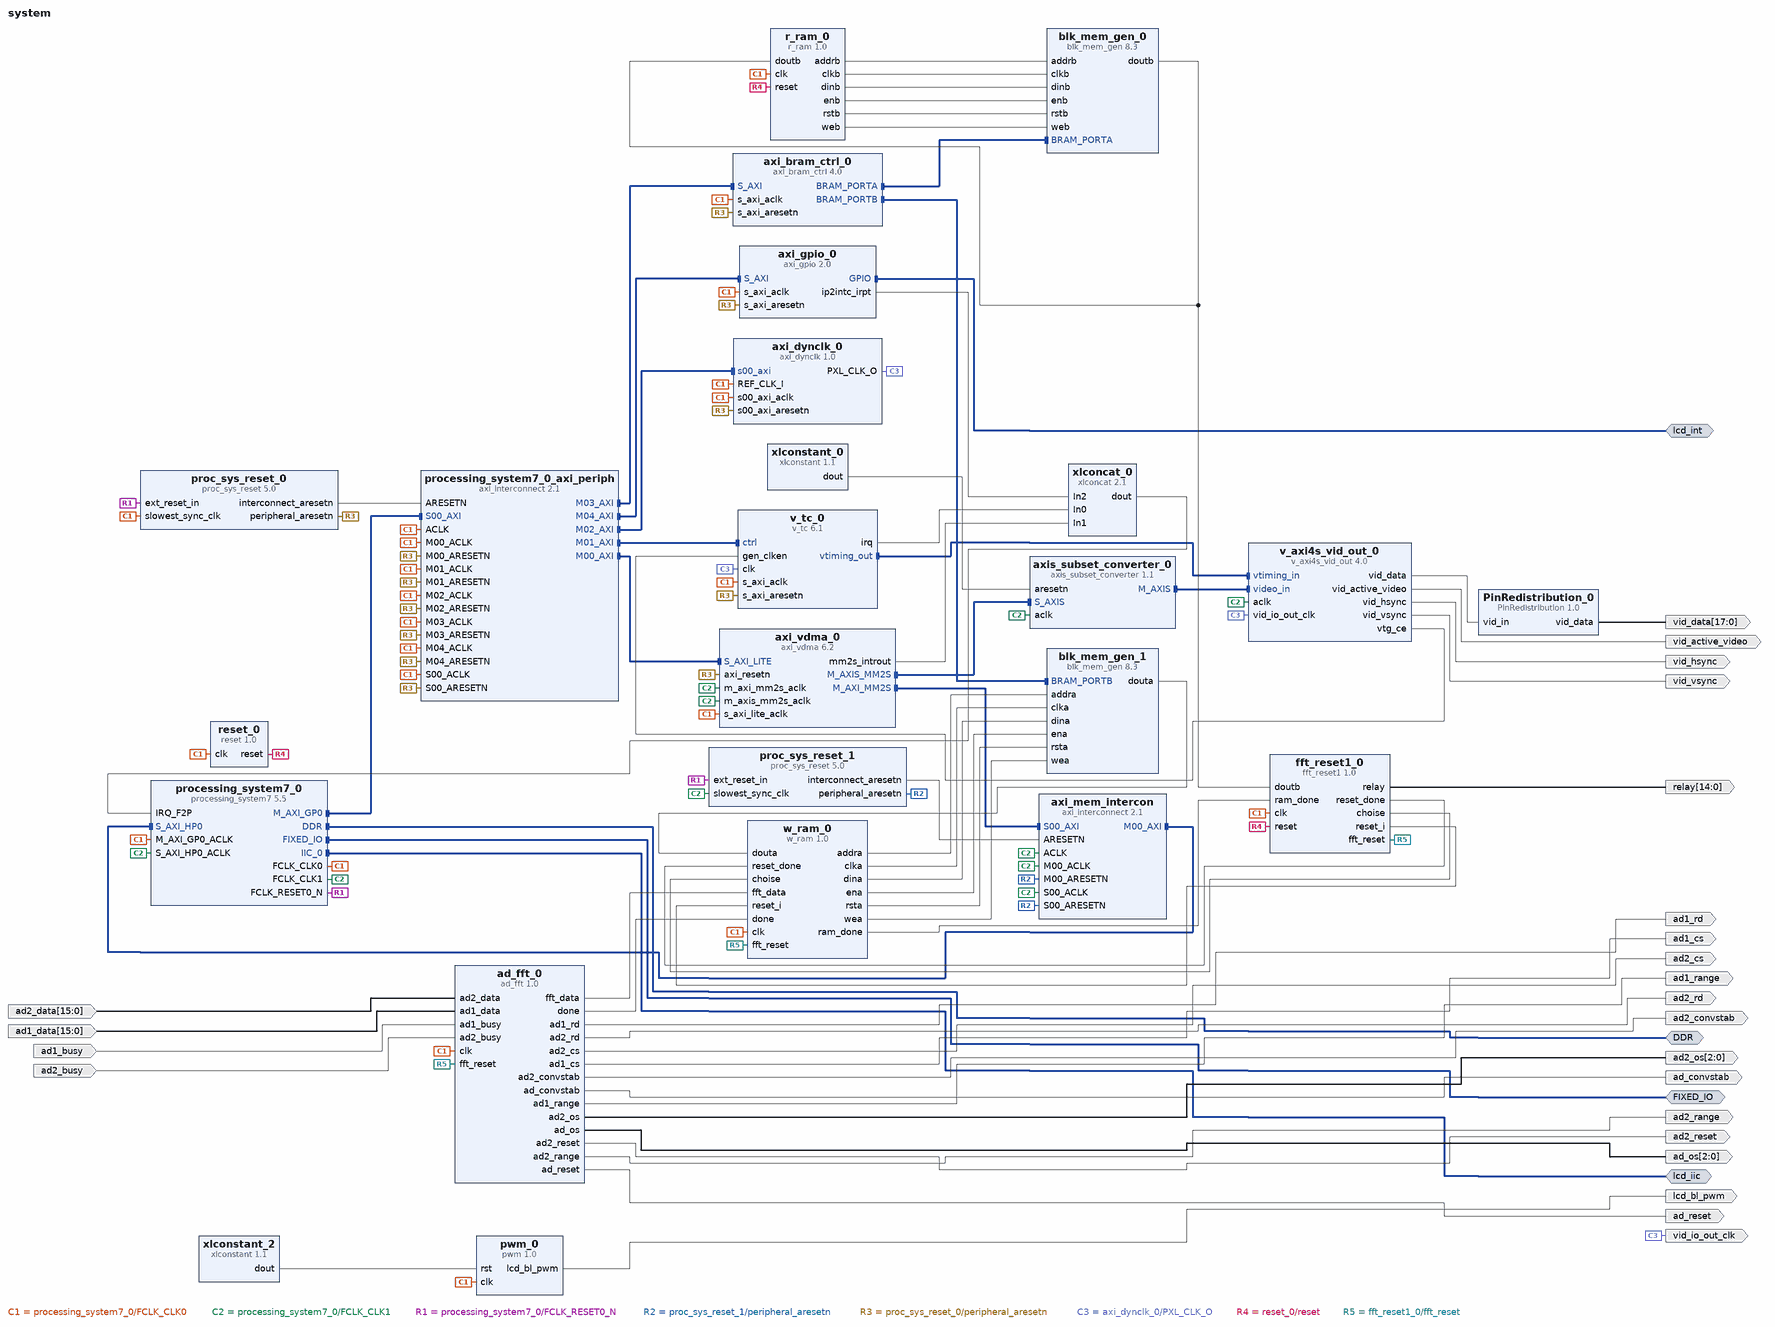
[diagram p0: block diagram of the top level]
# Vivado block design system, Vivado 2015.4
create_bd_design system

create_bd_intf_port -mode Master -vlnv xilinx.com:interface:ddrx_rtl:1.0 DDR
create_bd_intf_port -mode Master -vlnv xilinx.com:display_processing_system7:fixedio_rtl:1.0 FIXED_IO
create_bd_intf_port -mode Master -vlnv xilinx.com:interface:iic_rtl:1.0 lcd_iic
create_bd_intf_port -mode Master -vlnv xilinx.com:interface:gpio_rtl:1.0 lcd_int
create_bd_port -dir O -type clk vid_io_out_clk
create_bd_port -dir O vid_active_video
create_bd_port -dir O vid_hsync
create_bd_port -dir O vid_vsync
create_bd_port -dir O lcd_bl_pwm
create_bd_port -dir I -from 15 -to 0 ad2_data
create_bd_port -dir I -from 15 -to 0 ad1_data
create_bd_port -dir I ad1_busy
create_bd_port -dir I ad2_busy
create_bd_port -dir O ad2_rd
create_bd_port -dir O ad1_rd
create_bd_port -dir O ad2_cs
create_bd_port -dir O ad_convstab
create_bd_port -dir O -from 2 -to 0 ad_os
create_bd_port -dir O ad1_cs
create_bd_port -dir O ad2_convstab
create_bd_port -dir O -type rst ad2_reset
create_bd_port -dir O -type rst ad_reset
create_bd_port -dir O -from 2 -to 0 ad2_os
create_bd_port -dir O ad1_range
create_bd_port -dir O ad2_range
create_bd_port -dir O -from 14 -to 0 relay
create_bd_port -dir O -from 17 -to 0 vid_data

create_bd_cell -type ip -vlnv digilentinc.com:ip:axi_dynclk:1.0 axi_dynclk_0
create_bd_cell -type ip -vlnv xilinx.com:ip:axi_gpio:2.0 axi_gpio_0
set_property -dict {CONFIG.C_GPIO_WIDTH 1 CONFIG.C_ALL_INPUTS 1 CONFIG.C_INTERRUPT_PRESENT 1} [get_bd_cells axi_gpio_0]
create_bd_cell -type ip -vlnv xilinx.com:ip:axi_interconnect:2.1 axi_mem_intercon
set_property -dict {CONFIG.NUM_MI 1} [get_bd_cells axi_mem_intercon]
create_bd_cell -type ip -vlnv xilinx.com:ip:axi_vdma:6.2 axi_vdma_0
set_property -dict [list \
  CONFIG.c_num_fstores 1 \
  CONFIG.c_mm2s_genlock_mode 0 \
  CONFIG.c_mm2s_linebuffer_depth 4096 \
  CONFIG.c_include_s2mm 0 \
  CONFIG.c_include_mm2s_dre 1 \
] [get_bd_cells axi_vdma_0]
create_bd_cell -type ip -vlnv xilinx.com:ip:axis_subset_converter:1.1 axis_subset_converter_0
set_property -dict [list \
  CONFIG.S_TDATA_NUM_BYTES 4 \
  CONFIG.M_TDATA_NUM_BYTES 3 \
  CONFIG.S_TUSER_WIDTH 1 \
  CONFIG.M_TUSER_WIDTH 1 \
  CONFIG.S_HAS_TKEEP 1 \
  CONFIG.S_HAS_TLAST 1 \
  CONFIG.M_HAS_TKEEP 1 \
  CONFIG.M_HAS_TLAST 1 \
  CONFIG.TDATA_REMAP {tdata[23:16],tdata[15:8],tdata[7:0]} \
  CONFIG.TUSER_REMAP {tuser[0:0]} \
  CONFIG.TKEEP_REMAP {tkeep[2:0]} \
  CONFIG.TLAST_REMAP {tlast[0]} \
] [get_bd_cells axis_subset_converter_0]
create_bd_cell -type ip -vlnv xilinx.com:ip:processing_system7:5.5 processing_system7_0
set_property -dict [list \
  CONFIG.PCW_APU_PERIPHERAL_FREQMHZ 767 \
  CONFIG.PCW_FPGA0_PERIPHERAL_FREQMHZ 100 \
  CONFIG.PCW_FPGA1_PERIPHERAL_FREQMHZ 150 \
  CONFIG.PCW_USE_S_AXI_HP0 1 \
  CONFIG.PCW_USE_FABRIC_INTERRUPT 1 \
  CONFIG.PCW_EN_CLK1_PORT 1 \
  CONFIG.PCW_IRQ_F2P_INTR 1 \
  CONFIG.PCW_PRESET_BANK1_VOLTAGE {LVCMOS 1.8V} \
  CONFIG.PCW_UIPARAM_DDR_PARTNO {MT41J256M16 RE-125} \
  CONFIG.PCW_QSPI_PERIPHERAL_ENABLE 1 \
  CONFIG.PCW_QSPI_QSPI_IO {MIO 1 .. 6} \
  CONFIG.PCW_QSPI_GRP_SINGLE_SS_ENABLE 1 \
  CONFIG.PCW_SD0_PERIPHERAL_ENABLE 1 \
  CONFIG.PCW_SD0_SD0_IO {MIO 40 .. 45} \
  CONFIG.PCW_SD0_GRP_CD_ENABLE 1 \
  CONFIG.PCW_SD0_GRP_CD_IO {MIO 47} \
  CONFIG.PCW_UART1_PERIPHERAL_ENABLE 1 \
  CONFIG.PCW_UART1_UART1_IO {MIO 48 .. 49} \
  CONFIG.PCW_TTC0_PERIPHERAL_ENABLE 1 \
  CONFIG.PCW_TTC1_PERIPHERAL_ENABLE 1 \
  CONFIG.PCW_I2C0_PERIPHERAL_ENABLE 1 \
  CONFIG.PCW_I2C1_PERIPHERAL_ENABLE 1 \
] [get_bd_cells processing_system7_0]
# 13 more settings of processing_system7_0 are not shown: defaults, MIO pin electricals, DDR timing, and values the tool derives
create_bd_cell -type ip -vlnv xilinx.com:ip:axi_interconnect:2.1 processing_system7_0_axi_periph
set_property -dict {CONFIG.NUM_MI 5} [get_bd_cells processing_system7_0_axi_periph]
create_bd_cell -type ip -vlnv xilinx.com:ip:proc_sys_reset:5.0 proc_sys_reset_0
create_bd_cell -type ip -vlnv xilinx.com:ip:proc_sys_reset:5.0 proc_sys_reset_1
create_bd_cell -type ip -vlnv xilinx.com:ip:v_axi4s_vid_out:4.0 v_axi4s_vid_out_0
set_property -dict [list \
  CONFIG.C_S_AXIS_VIDEO_FORMAT 2 \
  CONFIG.C_S_AXIS_VIDEO_DATA_WIDTH 8 \
  CONFIG.C_HAS_ASYNC_CLK 1 \
  CONFIG.C_ADDR_WIDTH 12 \
  CONFIG.C_VTG_MASTER_SLAVE 1 \
] [get_bd_cells v_axi4s_vid_out_0]
create_bd_cell -type ip -vlnv xilinx.com:ip:v_tc:6.1 v_tc_0
set_property -dict {CONFIG.enable_detection false} [get_bd_cells v_tc_0]
create_bd_cell -type ip -vlnv xilinx.com:ip:xlconcat:2.1 xlconcat_0
set_property -dict {CONFIG.NUM_PORTS 3} [get_bd_cells xlconcat_0]
create_bd_cell -type ip -vlnv xilinx.com:ip:xlconstant:1.1 xlconstant_0
create_bd_cell -type ip -vlnv xilinx.com:user:pwm:1.0 pwm_0
create_bd_cell -type ip -vlnv xilinx.com:ip:xlconstant:1.1 xlconstant_2
set_property -dict {CONFIG.CONST_VAL 0} [get_bd_cells xlconstant_2]
create_bd_cell -type ip -vlnv xilinx.com:ip:blk_mem_gen:8.3 blk_mem_gen_0
set_property -dict [list \
  CONFIG.Memory_Type True_Dual_Port_RAM \
  CONFIG.Enable_B Use_ENB_Pin \
  CONFIG.Use_RSTB_Pin true \
  CONFIG.Port_B_Clock 100 \
  CONFIG.Port_B_Write_Rate 50 \
  CONFIG.Port_B_Enable_Rate 100 \
] [get_bd_cells blk_mem_gen_0]
create_bd_cell -type ip -vlnv xilinx.com:ip:axi_bram_ctrl:4.0 axi_bram_ctrl_0
create_bd_cell -type ip -vlnv xilinx.com:ip:blk_mem_gen:8.3 blk_mem_gen_1
set_property -dict [list \
  CONFIG.Memory_Type True_Dual_Port_RAM \
  CONFIG.Enable_B Use_ENB_Pin \
  CONFIG.Use_RSTB_Pin true \
  CONFIG.Port_B_Clock 100 \
  CONFIG.Port_B_Write_Rate 50 \
  CONFIG.Port_B_Enable_Rate 100 \
] [get_bd_cells blk_mem_gen_1]
create_bd_cell -type ip -vlnv xilinx.com:user:r_ram:1.0 r_ram_0
create_bd_cell -type ip -vlnv xilinx.com:user:reset:1.0 reset_0
create_bd_cell -type ip -vlnv xilinx.com:user:w_ram:1.0 w_ram_0
create_bd_cell -type ip -vlnv xilinx.com:user:ad_fft:1.0 ad_fft_0
create_bd_cell -type ip -vlnv xilinx.com:user:fft_reset1:1.0 fft_reset1_0
create_bd_cell -type ip -vlnv xilinx.com:user:PinRedistribution:1.0 PinRedistribution_0

# ---- connections ----

connect_bd_intf_net [get_bd_intf_pins axi_vdma_0/M_AXI_MM2S] [get_bd_intf_pins axi_mem_intercon/S00_AXI]
connect_bd_intf_net [get_bd_intf_pins axi_mem_intercon/M00_AXI] [get_bd_intf_pins processing_system7_0/S_AXI_HP0]
connect_bd_intf_net [get_bd_intf_pins processing_system7_0/M_AXI_GP0] [get_bd_intf_pins processing_system7_0_axi_periph/S00_AXI]
connect_bd_intf_net [get_bd_intf_pins processing_system7_0_axi_periph/M00_AXI] [get_bd_intf_pins axi_vdma_0/S_AXI_LITE]
connect_bd_intf_net [get_bd_intf_pins axi_vdma_0/M_AXIS_MM2S] [get_bd_intf_pins axis_subset_converter_0/S_AXIS]
connect_bd_intf_net [get_bd_intf_pins axis_subset_converter_0/M_AXIS] [get_bd_intf_pins v_axi4s_vid_out_0/video_in]
connect_bd_intf_net [get_bd_intf_pins processing_system7_0_axi_periph/M01_AXI] [get_bd_intf_pins v_tc_0/ctrl]
connect_bd_intf_net [get_bd_intf_pins v_tc_0/vtiming_out] [get_bd_intf_pins v_axi4s_vid_out_0/vtiming_in]
connect_bd_intf_net [get_bd_intf_pins processing_system7_0_axi_periph/M02_AXI] [get_bd_intf_pins axi_dynclk_0/s00_axi]
connect_bd_intf_net [get_bd_intf_pins processing_system7_0_axi_periph/M04_AXI] [get_bd_intf_pins axi_gpio_0/S_AXI]
connect_bd_intf_net [get_bd_intf_pins processing_system7_0_axi_periph/M03_AXI] [get_bd_intf_pins axi_bram_ctrl_0/S_AXI]
connect_bd_intf_net [get_bd_intf_pins blk_mem_gen_0/BRAM_PORTA] [get_bd_intf_pins axi_bram_ctrl_0/BRAM_PORTA]
connect_bd_intf_net [get_bd_intf_pins axi_bram_ctrl_0/BRAM_PORTB] [get_bd_intf_pins blk_mem_gen_1/BRAM_PORTB]
connect_bd_intf_net [get_bd_intf_ports DDR] [get_bd_intf_pins processing_system7_0/DDR]
connect_bd_intf_net [get_bd_intf_ports FIXED_IO] [get_bd_intf_pins processing_system7_0/FIXED_IO]
connect_bd_intf_net [get_bd_intf_ports lcd_iic] [get_bd_intf_pins processing_system7_0/IIC_0]
connect_bd_intf_net [get_bd_intf_ports lcd_int] [get_bd_intf_pins axi_gpio_0/GPIO]
connect_bd_net [get_bd_pins processing_system7_0/FCLK_CLK0] \
  [get_bd_pins axi_dynclk_0/REF_CLK_I] [get_bd_pins axi_dynclk_0/s00_axi_aclk] [get_bd_pins axi_gpio_0/s_axi_aclk] \
  [get_bd_pins axi_vdma_0/s_axi_lite_aclk] [get_bd_pins processing_system7_0/M_AXI_GP0_ACLK] \
  [get_bd_pins proc_sys_reset_0/slowest_sync_clk] [get_bd_pins v_tc_0/s_axi_aclk] [get_bd_pins pwm_0/clk] \
  [get_bd_pins axi_bram_ctrl_0/s_axi_aclk] [get_bd_pins r_ram_0/clk] [get_bd_pins reset_0/clk] [get_bd_pins w_ram_0/clk] \
  [get_bd_pins ad_fft_0/clk] [get_bd_pins fft_reset1_0/clk] [get_bd_pins processing_system7_0_axi_periph/ACLK] \
  [get_bd_pins processing_system7_0_axi_periph/S00_ACLK] [get_bd_pins processing_system7_0_axi_periph/M00_ACLK] \
  [get_bd_pins processing_system7_0_axi_periph/M01_ACLK] [get_bd_pins processing_system7_0_axi_periph/M02_ACLK] \
  [get_bd_pins processing_system7_0_axi_periph/M03_ACLK] [get_bd_pins processing_system7_0_axi_periph/M04_ACLK]
connect_bd_net [get_bd_pins processing_system7_0/FCLK_CLK1] \
  [get_bd_pins axi_vdma_0/m_axi_mm2s_aclk] [get_bd_pins axi_vdma_0/m_axis_mm2s_aclk] \
  [get_bd_pins axis_subset_converter_0/aclk] [get_bd_pins processing_system7_0/S_AXI_HP0_ACLK] \
  [get_bd_pins proc_sys_reset_1/slowest_sync_clk] [get_bd_pins v_axi4s_vid_out_0/aclk] [get_bd_pins axi_mem_intercon/ACLK] \
  [get_bd_pins axi_mem_intercon/S00_ACLK] [get_bd_pins axi_mem_intercon/M00_ACLK]
connect_bd_net [get_bd_pins processing_system7_0/FCLK_RESET0_N] \
  [get_bd_pins proc_sys_reset_0/ext_reset_in] [get_bd_pins proc_sys_reset_1/ext_reset_in]
connect_bd_net -net rst_processing_system7_0_140M_peripheral_aresetn [get_bd_pins proc_sys_reset_1/peripheral_aresetn] \
  [get_bd_pins axi_mem_intercon/S00_ARESETN] [get_bd_pins axi_mem_intercon/M00_ARESETN]
connect_bd_net -net rst_processing_system7_0_140M_interconnect_aresetn [get_bd_pins proc_sys_reset_1/interconnect_aresetn] \
  [get_bd_pins axi_mem_intercon/ARESETN]
connect_bd_net -net rst_processing_system7_0_100M_peripheral_aresetn [get_bd_pins proc_sys_reset_0/peripheral_aresetn] \
  [get_bd_pins axi_dynclk_0/s00_axi_aresetn] [get_bd_pins axi_gpio_0/s_axi_aresetn] [get_bd_pins axi_vdma_0/axi_resetn] \
  [get_bd_pins v_tc_0/s_axi_aresetn] [get_bd_pins axi_bram_ctrl_0/s_axi_aresetn] \
  [get_bd_pins processing_system7_0_axi_periph/S00_ARESETN] [get_bd_pins processing_system7_0_axi_periph/M00_ARESETN] \
  [get_bd_pins processing_system7_0_axi_periph/M01_ARESETN] [get_bd_pins processing_system7_0_axi_periph/M02_ARESETN] \
  [get_bd_pins processing_system7_0_axi_periph/M03_ARESETN] [get_bd_pins processing_system7_0_axi_periph/M04_ARESETN]
connect_bd_net -net rst_processing_system7_0_100M_interconnect_aresetn [get_bd_pins proc_sys_reset_0/interconnect_aresetn] \
  [get_bd_pins processing_system7_0_axi_periph/ARESETN]
connect_bd_net [get_bd_pins xlconstant_0/dout] [get_bd_pins axis_subset_converter_0/aresetn]
connect_bd_net [get_bd_pins v_axi4s_vid_out_0/vtg_ce] [get_bd_pins v_tc_0/gen_clken]
connect_bd_net [get_bd_pins xlconcat_0/dout] [get_bd_pins processing_system7_0/IRQ_F2P]
connect_bd_net [get_bd_pins axi_vdma_0/mm2s_introut] [get_bd_pins xlconcat_0/In1]
connect_bd_net [get_bd_pins axi_dynclk_0/PXL_CLK_O] \
  [get_bd_ports vid_io_out_clk] [get_bd_pins v_axi4s_vid_out_0/vid_io_out_clk] [get_bd_pins v_tc_0/clk]
connect_bd_net [get_bd_pins v_tc_0/irq] [get_bd_pins xlconcat_0/In0]
connect_bd_net [get_bd_pins axi_gpio_0/ip2intc_irpt] [get_bd_pins xlconcat_0/In2]
connect_bd_net [get_bd_pins v_axi4s_vid_out_0/vid_active_video] [get_bd_ports vid_active_video]
connect_bd_net [get_bd_pins v_axi4s_vid_out_0/vid_hsync] [get_bd_ports vid_hsync]
connect_bd_net -net vid_vsync [get_bd_pins v_axi4s_vid_out_0/vid_vsync] [get_bd_ports vid_vsync]
connect_bd_net [get_bd_pins xlconstant_2/dout] [get_bd_pins pwm_0/rst]
connect_bd_net [get_bd_pins pwm_0/lcd_bl_pwm] [get_bd_ports lcd_bl_pwm]
connect_bd_net [get_bd_pins r_ram_0/addrb] [get_bd_pins blk_mem_gen_0/addrb]
connect_bd_net [get_bd_pins r_ram_0/clkb] [get_bd_pins blk_mem_gen_0/clkb]
connect_bd_net [get_bd_pins r_ram_0/dinb] [get_bd_pins blk_mem_gen_0/dinb]
connect_bd_net [get_bd_pins r_ram_0/enb] [get_bd_pins blk_mem_gen_0/enb]
connect_bd_net [get_bd_pins r_ram_0/rstb] [get_bd_pins blk_mem_gen_0/rstb]
connect_bd_net [get_bd_pins r_ram_0/web] [get_bd_pins blk_mem_gen_0/web]
connect_bd_net [get_bd_pins blk_mem_gen_0/doutb] [get_bd_pins r_ram_0/doutb] [get_bd_pins fft_reset1_0/doutb]
connect_bd_net [get_bd_pins reset_0/reset] [get_bd_pins r_ram_0/reset] [get_bd_pins fft_reset1_0/reset]
connect_bd_net [get_bd_pins fft_reset1_0/fft_reset] [get_bd_pins w_ram_0/fft_reset] [get_bd_pins ad_fft_0/fft_reset]
connect_bd_net [get_bd_pins w_ram_0/addra] [get_bd_pins blk_mem_gen_1/addra]
connect_bd_net [get_bd_pins w_ram_0/clka] [get_bd_pins blk_mem_gen_1/clka]
connect_bd_net [get_bd_pins w_ram_0/dina] [get_bd_pins blk_mem_gen_1/dina]
connect_bd_net [get_bd_pins w_ram_0/ena] [get_bd_pins blk_mem_gen_1/ena]
connect_bd_net [get_bd_pins w_ram_0/rsta] [get_bd_pins blk_mem_gen_1/rsta]
connect_bd_net [get_bd_pins w_ram_0/wea] [get_bd_pins blk_mem_gen_1/wea]
connect_bd_net [get_bd_pins blk_mem_gen_1/douta] [get_bd_pins w_ram_0/douta]
connect_bd_net [get_bd_pins ad_fft_0/fft_data] [get_bd_pins w_ram_0/fft_data]
connect_bd_net [get_bd_pins ad_fft_0/done] [get_bd_pins w_ram_0/done]
connect_bd_net [get_bd_ports ad2_data] [get_bd_pins ad_fft_0/ad2_data]
connect_bd_net [get_bd_ports ad1_data] [get_bd_pins ad_fft_0/ad1_data]
connect_bd_net [get_bd_ports ad1_busy] [get_bd_pins ad_fft_0/ad1_busy]
connect_bd_net [get_bd_ports ad2_busy] [get_bd_pins ad_fft_0/ad2_busy]
connect_bd_net [get_bd_pins ad_fft_0/ad2_rd] [get_bd_ports ad2_rd]
connect_bd_net [get_bd_pins ad_fft_0/ad1_rd] [get_bd_ports ad1_rd]
connect_bd_net [get_bd_pins ad_fft_0/ad2_cs] [get_bd_ports ad2_cs]
connect_bd_net [get_bd_pins ad_fft_0/ad_convstab] [get_bd_ports ad_convstab]
connect_bd_net [get_bd_pins ad_fft_0/ad_os] [get_bd_ports ad_os]
connect_bd_net [get_bd_pins ad_fft_0/ad1_cs] [get_bd_ports ad1_cs]
connect_bd_net [get_bd_pins ad_fft_0/ad2_convstab] [get_bd_ports ad2_convstab]
connect_bd_net [get_bd_pins ad_fft_0/ad2_reset] [get_bd_ports ad2_reset]
connect_bd_net [get_bd_pins ad_fft_0/ad_reset] [get_bd_ports ad_reset]
connect_bd_net [get_bd_pins ad_fft_0/ad2_os] [get_bd_ports ad2_os]
connect_bd_net [get_bd_pins ad_fft_0/ad1_range] [get_bd_ports ad1_range]
connect_bd_net [get_bd_pins ad_fft_0/ad2_range] [get_bd_ports ad2_range]
connect_bd_net [get_bd_pins w_ram_0/ram_done] [get_bd_pins fft_reset1_0/ram_done]
connect_bd_net [get_bd_pins fft_reset1_0/reset_done] [get_bd_pins w_ram_0/reset_done]
connect_bd_net [get_bd_pins fft_reset1_0/choise] [get_bd_pins w_ram_0/choise]
connect_bd_net [get_bd_pins fft_reset1_0/reset_i] [get_bd_pins w_ram_0/reset_i]
connect_bd_net [get_bd_pins fft_reset1_0/relay] [get_bd_ports relay]
connect_bd_net [get_bd_pins v_axi4s_vid_out_0/vid_data] [get_bd_pins PinRedistribution_0/vid_in]
connect_bd_net [get_bd_pins PinRedistribution_0/vid_data] [get_bd_ports vid_data]

# ---- address map ----
assign_bd_address -offset 0x00000000 -range 1G -target_address_space [get_bd_addr_spaces axi_vdma_0/Data_MM2S] [get_bd_addr_segs processing_system7_0/S_AXI_HP0/HP0_DDR_LOWOCM]
assign_bd_address -offset 0x40000000 -range 8K -target_address_space [get_bd_addr_spaces processing_system7_0/Data] [get_bd_addr_segs axi_bram_ctrl_0/S_AXI/Mem0]
assign_bd_address -offset 0x41200000 -range 64K -target_address_space [get_bd_addr_spaces processing_system7_0/Data] [get_bd_addr_segs axi_gpio_0/S_AXI/Reg]
assign_bd_address -offset 0x43000000 -range 64K -target_address_space [get_bd_addr_spaces processing_system7_0/Data] [get_bd_addr_segs axi_vdma_0/S_AXI_LITE/Reg]
assign_bd_address -offset 0x43C00000 -range 64K -target_address_space [get_bd_addr_spaces processing_system7_0/Data] [get_bd_addr_segs v_tc_0/ctrl/Reg]
assign_bd_address -offset 0x43C10000 -range 64K -target_address_space [get_bd_addr_spaces processing_system7_0/Data] [get_bd_addr_segs axi_dynclk_0/s00_axi/reg0]

validate_bd_design
save_bd_design
